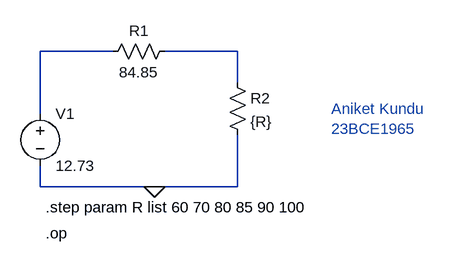
[diagram p0: schematic Draft1.asc]
Draft1.asc, the LTspice schematic file:
Version 4
SHEET 1 1008 680
WIRE 512 80 400 80
WIRE 704 80 592 80
WIRE 704 128 704 80
WIRE 400 176 400 80
WIRE 400 288 400 256
WIRE 576 288 400 288
WIRE 704 288 704 208
WIRE 704 288 576 288
FLAG 576 288 0
SYMBOL voltage 400 160 R0
SYMATTR InstName V1
SYMATTR Value 12.73
SYMBOL res 608 64 R90
WINDOW 0 0 56 VBottom 2
WINDOW 3 32 56 VTop 2
SYMATTR InstName R1
SYMATTR Value 84.85
SYMBOL res 688 112 R0
SYMATTR InstName R2
SYMATTR Value {R}
TEXT 408 320 Left 2 !.step param R list 60 70 80 85 90 100
TEXT 848 168 Left 2 ;Aniket Kundu \n23BCE1965
TEXT 408 360 Left 2 !.op

The netlist it stands for:
* Draft1.asc
V1 N001 0 12.73
R1 N002 N001 84.85
R2 N002 0 {R}
.step param R list 60 70 80 85 90 100
* Aniket Kundu
* 23BCE1965
.op
.backanno
.end